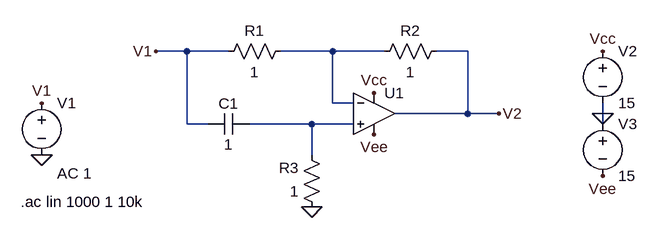
[diagram p0: schematic Simulacion LTspice.asc]
Simulacion LTspice.asc, the LTspice schematic file:
Version 4
SHEET 1 916 680
WIRE 96 80 48 80
WIRE 160 80 96 80
WIRE 320 80 240 80
WIRE 400 80 320 80
WIRE 528 80 480 80
WIRE 320 160 320 80
WIRE 352 160 320 160
WIRE 528 176 528 80
WIRE 528 176 416 176
WIRE 576 176 528 176
WIRE 736 176 736 160
WIRE 96 192 96 80
WIRE 128 192 96 192
WIRE 288 192 192 192
WIRE 352 192 288 192
WIRE 736 192 736 176
WIRE 288 240 288 192
FLAG 48 80 V1
FLAG -128 160 V1
FLAG -128 240 0
FLAG 288 320 0
FLAG 576 176 V2
FLAG 736 80 Vcc
FLAG 384 144 Vcc
FLAG 384 208 Vee
FLAG 736 272 Vee
FLAG 736 176 0
SYMBOL res 256 64 R90
WINDOW 0 0 56 VBottom 2
WINDOW 3 32 56 VTop 2
SYMATTR InstName R1
SYMATTR Value 1
SYMBOL res 496 64 R90
WINDOW 0 0 56 VBottom 2
WINDOW 3 32 56 VTop 2
SYMATTR InstName R2
SYMATTR Value 1
SYMBOL res 304 336 R180
WINDOW 0 36 76 Left 2
WINDOW 3 36 40 Left 2
SYMATTR InstName R3
SYMATTR Value 1
SYMBOL cap 192 176 R90
WINDOW 0 0 32 VBottom 2
WINDOW 3 32 32 VTop 2
SYMATTR InstName C1
SYMATTR Value 1
SYMBOL voltage -128 144 R0
WINDOW 123 24 124 Left 2
WINDOW 39 0 0 Left 0
SYMATTR Value2 AC 1
SYMATTR InstName V1
SYMATTR Value ""
SYMBOL OpAmps\\UniversalOpAmp 384 176 R0
SYMATTR InstName U1
SYMBOL voltage 736 64 R0
WINDOW 123 0 0 Left 0
WINDOW 39 0 0 Left 0
SYMATTR InstName V2
SYMATTR Value 15
SYMBOL voltage 736 176 R0
WINDOW 123 0 0 Left 0
WINDOW 39 0 0 Left 0
SYMATTR InstName V3
SYMATTR Value 15
TEXT -160 312 Left 2 !.ac lin 1000 1 10k

The netlist it stands for:
* Simulacion LTspice.asc
R1 N001 V1 1
R2 V2 N001 1
R3 0 N002 1
C1 N002 V1 1
V1 V1 0 AC 1
XU1 N002 N001 Vcc Vee V2 level1 Avol=1Meg GBW=10Meg Vos=0 En=0 Enk=0 In=0 Ink=0 Rin=500Meg  ; pins In+ In- V+ V- OUT
V2 Vcc 0 15
V3 0 Vee 15
.ac lin 1000 1 10k
.lib UniversalOpAmp1.lib
.backanno
.end